# EAGLE schematic MiniMoto (EAGLE 6.4)
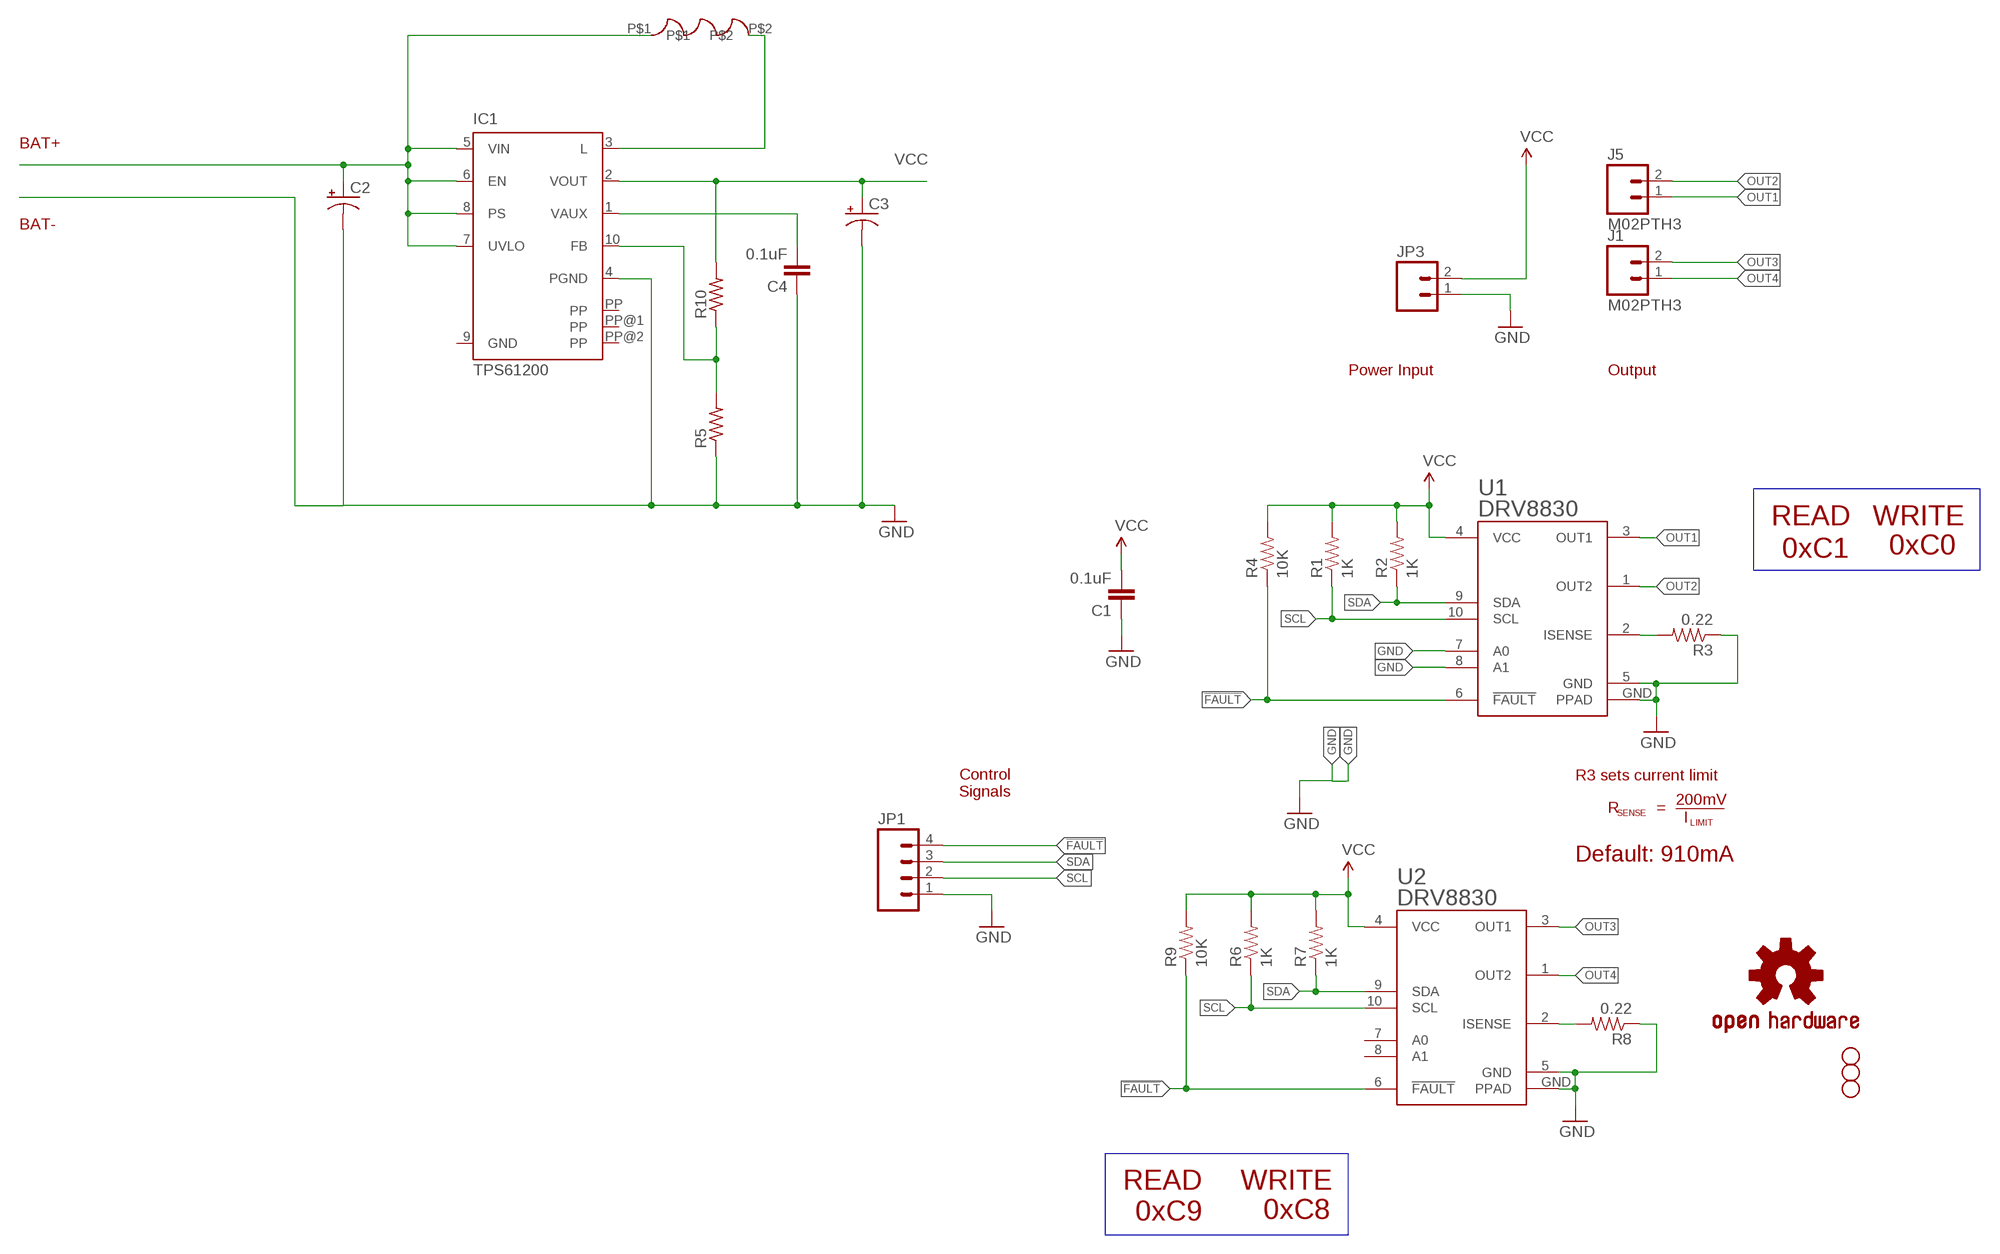
[diagram p0: schematic, sheet 1]

## Parts
2.2UH  VLF4012A  [VLF4012A]
C1  0.1uF  0.1UF-25V(+80/-20%)(0603)  [0603-CAP]
C2  CAP_POL1206  [EIA3216]
C3  CAP_POL1206  [EIA3216]
C4  0.1uF  0.1UF-25V(+80/-20%)(0603)  [0603-CAP]
IC1  TPS61200  [S-PDSO-N10]
J1  M02PTH3  [1X02_LONGPADS]
J5  M02PTH3  [1X02_LONGPADS]
JP1  M04PTH  [1X04]
JP3  M02LOCK  [1X02_LOCK]
LOGO2  OSHW-LOGOS  [OSHW-LOGO-S]
R1  1K  1KOHM1/10W1%(0603)  [0603-RES]
R2  1K  1KOHM1/10W1%(0603)  [0603-RES]
R3  0.22  0.22OHM1/4W1%(0805)  [0805]
R4  10K  10KOHM1/10W1%(0603)0603  [0603-RES]
R5  R-US_M0805  [M0805]
R6  1K  1KOHM1/10W1%(0603)  [0603-RES]
R7  1K  1KOHM1/10W1%(0603)  [0603-RES]
R8  0.22  0.22OHM1/4W1%(0805)  [0805]
R9  10K  10KOHM1/10W1%(0603)0603  [0603-RES]
R10  R-US_M0805  [M0805]
STANDOFF1  STAND-OFF  [STAND-OFF]
STANDOFF2  STAND-OFF  [STAND-OFF]
STANDOFF3  STAND-OFF  [STAND-OFF]
U1  DRV8830  [MSOP-10-GNDPAD]
U2  DRV8830  [MSOP-10-GNDPAD]

## Nets
!FAULT: JP1.4 R4.1 R9.1 U1.6(!FAULT) U2.6(!FAULT)
BAT+: 2.2UH.P$1 C2.A(+) IC1.5(VIN) IC1.6(EN) IC1.7(UVLO) IC1.8(PS)
GND: C1.1 C2.C(-) C3.C(-) C4.1 IC1.4(PGND) JP1.1 JP3.1 R3.1 R5.1 R8.1 U1.5(GND) U1.7(A0) U1.8(A1) U1.GND(PPAD) U2.5(GND) U2.GND(PPAD)
N$2: R8.2 U2.2(ISENSE)
N$3: R3.2 U1.2(ISENSE)
N$5: 2.2UH.P$2 IC1.3(L)
N$7: IC1.10(FB) R5.2 R10.1
N$9: C4.2 IC1.1(VAUX)
OUT1: J5.1 U1.3(OUT1)
OUT2: J5.2 U1.1(OUT2)
OUT3: J1.2 U2.3(OUT1)
OUT4: J1.1 U2.1(OUT2)
SCL: JP1.2 R1.1 R6.1 U1.10(SCL) U2.10(SCL)
SDA: JP1.3 R2.1 R7.1 U1.9(SDA) U2.9(SDA)
VCC: C1.2 C3.A(+) IC1.2(VOUT) JP3.2 R1.2 R2.2 R4.2 R6.2 R7.2 R9.2 R10.2 U1.4(VCC) U2.4(VCC)
Unconnected: U2.7(A0) U2.8(A1)

## Buses
B$1

## Notes on the sheet
- BAT+
- BAT-
- Power Input | Output
- READ | WRITE
- 0xC1 | 0xC0
- R3 sets current limit
- Control
  Signals
- 200mV
- R | =
- SENSE
- I
- LIMIT
- Default: 910mA
- READ | WRITE
- 0xC9 | 0xC8

## Power pins joined to a net without a drawn wire
GND: IC1.9(GND)
PP: IC1.PP IC1.PP@1(PP) IC1.PP@2(PP)

## Library data of the parts
2.2UH = PEBBLE:VLF4012A
C1 C4 = SparkFun-Capacitors:0.1UF-25V(+80/-20%)(0603): Ceramic Standard decoupling cap CAP-00810; PROD_ID: CAP-00810
C2 C3 = SparkFun:CAP_POL: Capacitor Polarized These are standard SMD and PTH capacitors. Normally 10uF, 47uF, and 100uF in electrolytic and tantalum varieties. Always verify the external diameter of the through hole cap, it varies with capacity, voltage, and manufacturer. The EIA devices should be standard.
IC1 = texas:TPS6120*: LOW INPUT VOLTAGE SYNCHRONOUS BOOST CONVERTER WITH 1.3-A SWITCHES Source: http://focus.ti.com/lit/ds/symlink/tps61200.pdf; MPN: TPS61200DRCT; OC_FARNELL: 1471238; OC_NEWARK: 37M0066
J1 J5 = SparkFun-Connectors:M02: Standard 2-pin 0.1" header. Use with - straight break away headers ( PRT-00116) - right angle break away headers (PRT-00553) - swiss pins (PRT-00743) - machine pins (PRT-00117) - female headers (PRT-00115) Molex polarized connector foot print use with: PRT-08233 with associated crimp pins and housings. 2.54_SCREWTERM for use with PRT-10571. 3.5mm Screw Terminal footprints for PRT-08084 5mm Screw Terminal footprints for use with PRT-08433
JP1 = SparkFun:M04: Header 4 Standard 4-pin 0.1" header. Use with straight break away headers (SKU : PRT-00116), right angle break away headers (PRT-00553), swiss pins (PRT-00743), machine pins (PRT-00117), and female headers (PRT-00115). Molex polarized connector foot print use with SKU : PRT-08231 with associated crimp pins and housings. 1MM SMD Version SKU: PRT-10208
JP3 = SparkFun:M02: Header 2 Standard 2-pin 0.1" header. Use with straight break away headers (SKU : PRT-00116), right angle break away headers (PRT-00553), swiss pins (PRT-00743), machine pins (PRT-00117), and female headers (PRT-00115). Molex polarized connector foot print use with SKU : PRT-08233 with associated crimp pins and housings.
LOGO2 = SparkFun-Aesthetics:OSHW-LOGO: Open Source Hardware Logo This logo indicates the piece of hardware it is found on incorporates a OSHW license and/or adheres to the definition of open source hardware found here: http://freedomdefined.org/OSHW
R1 R2 R6 R7 = SparkFun-Resistors:1KOHM1/10W1%(0603): RES-07856; PROD_ID: RES-07856
R3 R8 = SparkFun-Resistors:0.22OHM1/4W1%(0805): RES-09883; PROD_ID: RES-09883
R4 R9 = SparkFun-Resistors:10KOHM1/10W1%(0603): RES-00824; PROD_ID: RES-00824
R5 R10 = resistor:R-US_: RESISTOR, American symbol
STANDOFF1-STANDOFF3 = SparkFun-Electromechanical:STAND-OFF: #4 Stand Off This is the mechanical footprint for a #4 phillips button head screw. Use the keepout ring to avoid running the screw head into surrounding components. SKU : PRT-00447
U1 U2 = SparkFun-PowerIC:DRV8830: DRV8830 I2C DC Motor Driver TSSOP-10 with exposed power pad 1A current limit, 2.75V to 6.8V